# Altium schematic sheet example connect.SchDoc
size A4; SheetNumber: 4; SheetTotal: 9
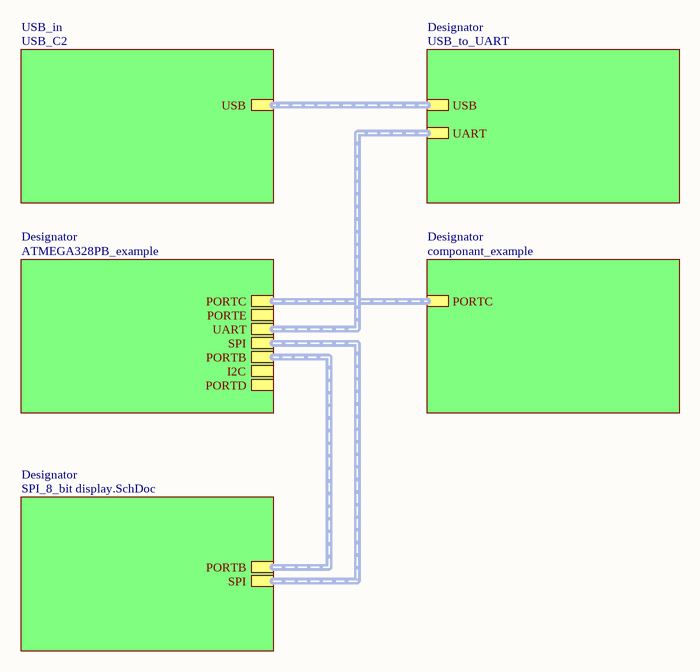
[diagram p0: example connect.SchDoc]

## Sub-sheets
Designator = ATMEGA328PB_example: PORTC (harness PORTC), PORTE (harness PORTE), UART (harness UART), SPI (harness SPI), PORTB (harness PORTB), I2C (harness I2C), PORTD (harness PORTD)
Designator = componant_example: PORTC (harness PORTC)
Designator = USB_to_UART: USB (harness USB), UART (harness UART)
Designator = SPI_8_bit display.SchDoc: SPI (harness SPI), PORTB (harness PORTB)
USB_in = USB_C2: USB (harness USB)

## Buses and harness runs
harness sheet Designator/USB = sheet USB_in/USB